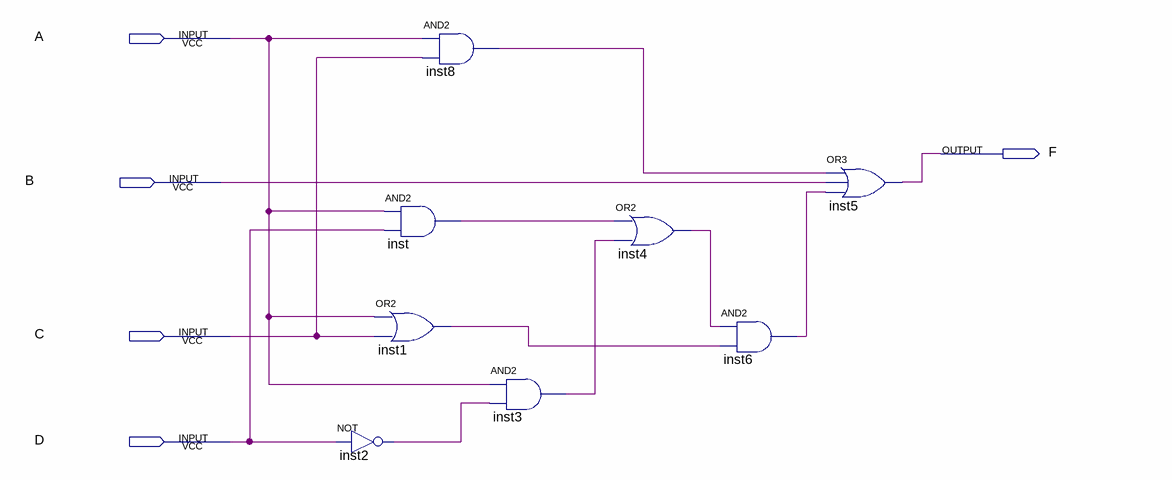
[diagram p0: schematic sheet]
// Quartus schematic Question4.bdf as structural Verilog: 8 symbols, 5 pins
module Question4 (
  input  A,
  input  B,
  input  C,
  input  D,
  output F
);

  wire inst1_out, inst2_out, inst3_out, inst4_out, inst6_out, inst8_out, inst_out;

  not inst2 (inst2_out, D);
  and inst (inst_out, A, D);
  or inst1 (inst1_out, A, C);
  and inst8 (inst8_out, A, C);
  and inst3 (inst3_out, A, inst2_out);
  or inst4 (inst4_out, inst_out, inst3_out);
  and inst6 (inst6_out, inst4_out, inst1_out);
  or inst5 (F, inst8_out, B, inst6_out);
endmodule
